# Altium schematic sheet OBD2.SchDoc
size A4; SheetNumber: 3; SheetTotal: 3
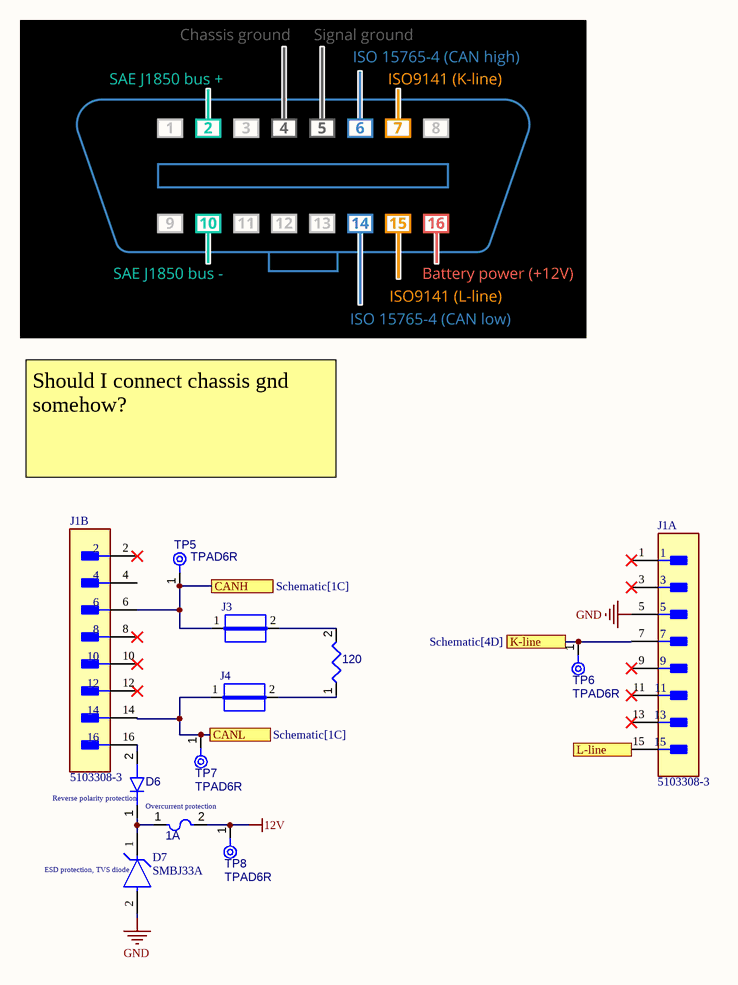
[diagram p0: OBD2.SchDoc]

## Parts
1A  Fuses  (value not drawn)
120  Resistors  (value not drawn)
D6  Diodes  (value not drawn)
D7  SMBJ33A  [FP-SMBJ-MFG]
J1  5103308-3  [FP-5103308-3-MFG]  (parts A,B of 2)
J3  JUMPER  [JUMPER]  (value not drawn)
J4  JUMPER  [JUMPER]  (value not drawn)
TP5  TPAD6R  [TP06R]  (no BOM)
TP6  TPAD6R  [TP06R]  (no BOM)
TP7  TPAD6R  [TP06R]  (no BOM)
TP8  TPAD6R  [TP06R]  (no BOM)

## Ports
CANH (see Schematic[1C]), CANL (see Schematic[1C]), K-line (see Schematic[4D]), L-line

## Nets
12V: 1A.2 TP8.1(TP)
GND: D7.2(A) J1.5
CANH: J1.6 J3.1 TP5.1(TP) ; port CANH
CANL: J1.14 J4.1 TP7.1(TP) ; port CANL
K-line: J1.7 TP6.1(TP) ; port K-line
L-line: J1.15 ; port L-line
Net1A_1: 1A.1 D6.1(K) D7.1(C)
Net120_1: 120.1 J4.2
Net120_2: 120.2 J3.2
NetD6_2: D6.2(A) J1.16

Not connected (* = marked no-connect by the designer): J1 1* 2* 3* 4 8* 9* 10* 11* 12* 13*

## Notes on the sheet
- Should I connect chassis gnd somehow?
- (near D6) Reverse polarity protection
- Overcurrent protection
- (near D7) ESD protection, TVS diode

## Library data of the parts
1A = Fuses: Fuse; Component Type: Fuses
120 = Resistors: Resistor; Component Type: Resistors
D6 = Diodes: Diode; Component Type: Diodes
D7 = CMP-2000-07095-2: TVS DIODE 33V 53.3V DO214AA; Manufacturer: Littelfuse Inc; Max Junction Temp: +150°C; Number Of Channels: 1; Breakdown Voltage: 36.7V; Description: 53.3V Clamp 11.3A Ipp Tvs Diode Surface Mount DO-214AA (SMBJ); Peak Pulse Power: 600W; Direction: Unidirectional; Peak Pulse Current: 11.3A; Lead Free: Yes; Height: 2.61mm; Temperature Range Low: -65°C; ComponentLink2URL: https://www.littelfuse.com/~/media/electronics/datasheets/tvs_diodes/littelfuse_tvs_diode_smbj_datasheet.pdf.pdf; Manufacturer Part Number: SMBJ33A; Clamping Voltage: 53.3V; Device Class L1: Circuit Protection; Octopart: https://octopart.com/smbj33a-littelfuse-350829; Device Class L2: TVS Diodes; Digikey Description: TVS DIODE 33V 53.3V DO214AA; Automotive: No; Temperature Range High: +150°C; Package: SMBJ; ComponentLink2Description: Datasheet; Mouser Description: TVS DIODE 33V 53.3V DO214AA; Reverse Standoff Voltage: 33V; Category: Diode; Device Class L3: unset; Temperature: -65°C to +150°C; RoHS: TRUE
J1 = CMP-03369-000164-1: CONN HEADER VERT 16POS 2.54MM; Number of Positions: 16; Packaging: Rail/Tube; Flammability Rating: UL94 V-0; Contact Finish - Mating: Gold or Gold-Palladium; Max Operating Temperature: 105°C; Contact Shape: Square; Connector Type: Header; Termination: Solder; Fastening Type: Pull; Insulation Color: Black; Min Operating Temperature: -65°C; RoHS Compliant: Yes; Contact Type: Male Pin; Series: AMP-LATCH; Mount: Through Hole; Number of Rows: 2; Contact Material: Brass
J3 J4 = CMP-009-00061-2: Pins: 2
TP5-TP8 = CMP-00028-00002-2: 0.6mm round; Pins: 1